# EAGLE design avr-programator (EAGLE 5.11)
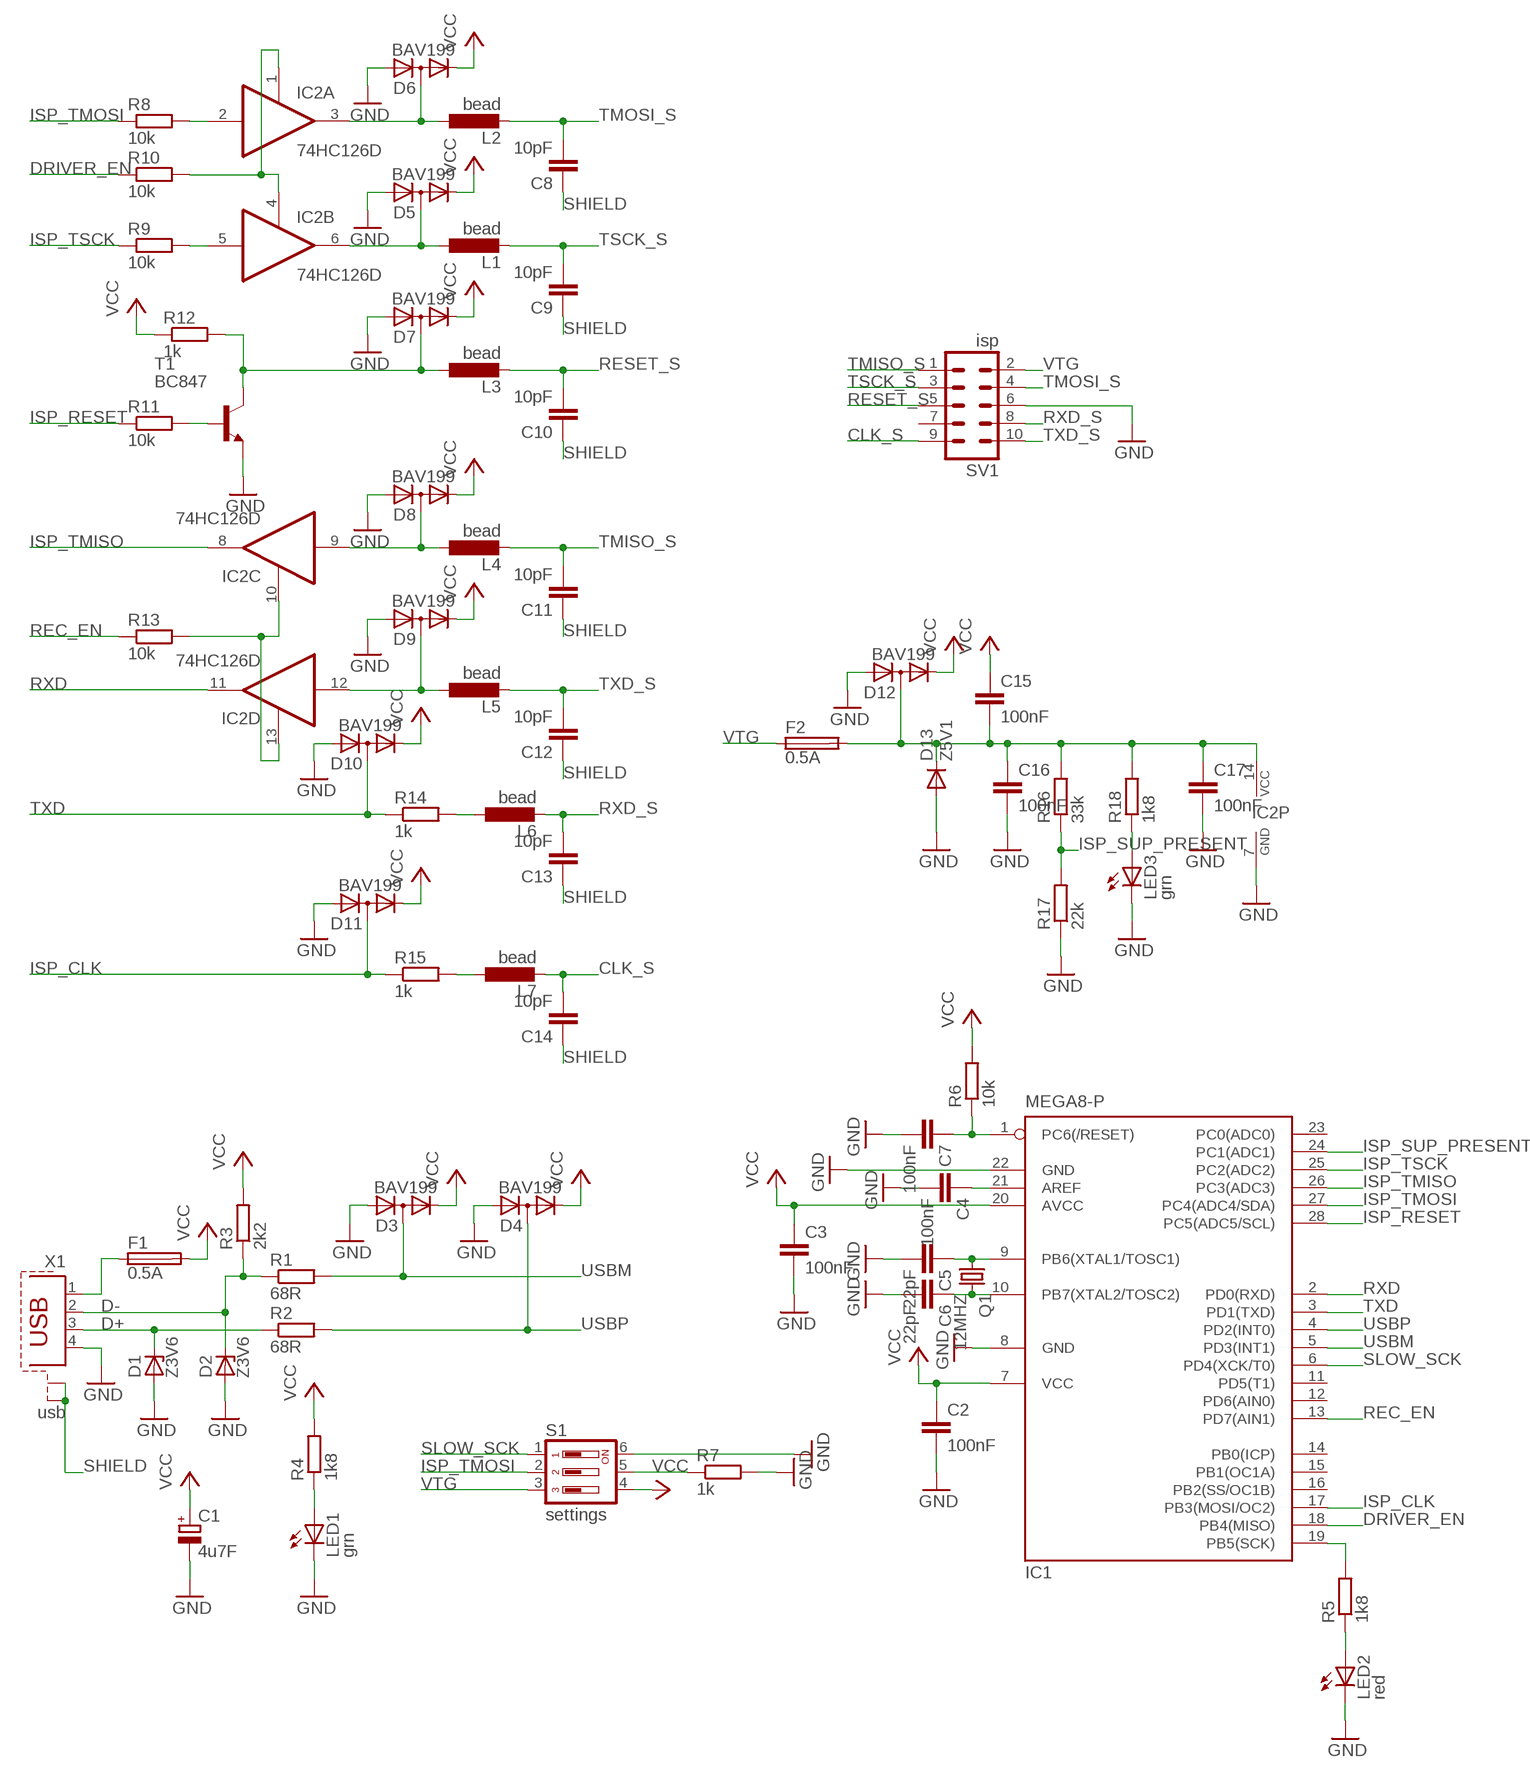
[diagram p0: schematic, sheet 1]

## Parts
C1  4u7F  CPOL-EUE2.5-5  [E2,5-5]
C2  100nF  C-EUC0805  [C0805]
C3  100nF  C-EUC0805  [C0805]
C4  100nF  C-EUC0805  [C0805]
C5  22pF  C-EUC0805  [C0805]
C6  22pF  C-EUC0805  [C0805]
C7  100nF  C-EUC0805  [C0805]
C8  10pF  C-EUC0805  [C0805]
C9  10pF  C-EUC0805  [C0805]
C10  10pF  C-EUC0805  [C0805]
C11  10pF  C-EUC0805  [C0805]
C12  10pF  C-EUC0805  [C0805]
C13  10pF  C-EUC0805  [C0805]
C14  10pF  C-EUC0805  [C0805]
C15  100nF  C-EUC0805  [C0805]
C16  100nF  C-EUC0805  [C0805]
C17  100nF  C-EUC0805  [C0805]
D1  Z3V6  1N4728  [DO41Z10]
D2  Z3V6  1N4728  [DO41Z10]
D3  BAV199  [SOT23]
D4  BAV199  [SOT23]
D5  BAV199  [SOT23]
D6  BAV199  [SOT23]
D7  BAV199  [SOT23]
D8  BAV199  [SOT23]
D9  BAV199  [SOT23]
D10  BAV199  [SOT23]
D11  BAV199  [SOT23]
D12  BAV199  [SOT23]
D13  Z5V1  DIODE-SOD523  [SOD523]
F1  0.5A  FUSE_0805  [0805]
F2  0.5A  FUSE_0805  [0805]
IC1  MEGA8-P  [DIL28-3]
IC2  74HC126D  [SO14]
L1  bead  L0805  [0805]
L2  bead  L0805  [0805]
L3  bead  L0805  [0805]
L4  bead  L0805  [0805]
L5  bead  L0805  [0805]
L6  bead  L0805  [0805]
L7  bead  L0805  [0805]
LED1  grn  LED3MM  [LED3MM]
LED2  red  LED3MM  [LED3MM]
LED3  grn  LED3MM  [LED3MM]
Q1  12MHZ  CRYSTALHC49S  [HC49/S]
R1  68R  R-EU_R0805  [R0805]
R2  68R  R-EU_R0805  [R0805]
R3  2k2  R-EU_R0805  [R0805]
R4  1k8  R-EU_R0805  [R0805]
R5  1k8  R-EU_0207/10  [0207/10]
R6  10k  R-EU_R0805  [R0805]
R7  1k  R-EU_R0805  [R0805]
R8  10k  R-EU_0207/12  [0207/12]
R9  10k  R-EU_0207/7  [0207/7]
R10  10k  R-EU_0207/7  [0207/7]
R11  10k  R-EU_0207/7  [0207/7]
R12  1k  R-EU_R0805  [R0805]
R13  10k  R-EU_0207/10  [0207/10]
R14  1k  R-EU_R0805  [R0805]
R15  1k  R-EU_R0805  [R0805]
R16  33k  R-EU_R0805  [R0805]
R17  22k  R-EU_R0805  [R0805]
R18  1k8  R-EU_0207/15  [0207/15]
S1  settings  DS03  [DS-03]
SV1  isp  ML10  [ML10]
T1  BC847  [SOT23]
X1  usb  MC32603  [MC32603P]

## Nets
CLK_S: C14.2 L7.2 SV1.9
D+: D1.C R2.1 X1.3
D-: D2.C R1.1 R3.1 X1.2
DRIVER_EN: IC1.18(PB4(MISO)) R10.1
GND: C1.- C2.2 C3.2 C4.2 C5.2 C6.2 C7.2 C16.2 C17.2 D1.A D2.A D3.1(A) D4.1(A) D5.1(A) D6.1(A) D7.1(A) D8.1(A) D9.1(A) D10.1(A) D11.1(A) D12.1(A) D13.A IC1.8(GND) IC1.22(GND) IC2.7(P:GND) LED1.K(C) LED2.K(C) LED3.K(C) R7.2 R17.1 S1.6 SV1.6 T1.2(E) X1.4
ISP_CLK: D11.3(AC) IC1.17(PB3(MOSI/OC2)) R15.1
ISP_RESET: IC1.28(PC5(ADC5/SCL)) R11.1
ISP_SUP_PRESENT: IC1.24(PC1(ADC1)) R16.1 R17.2
ISP_TMISO: IC1.26(PC3(ADC3)) IC2.8(C:O)
ISP_TMOSI: IC1.27(PC4(ADC4/SDA)) R8.1 S1.2
ISP_TSCK: IC1.25(PC2(ADC2)) R9.1
N$1: F1.1 X1.1
N$2: C4.1 IC1.21(AREF)
N$3: C6.1 IC1.10(PB7(XTAL2/TOSC2)) Q1.2
N$4: LED1.A R4.1
N$5: C5.1 IC1.9(PB6(XTAL1/TOSC1)) Q1.1
N$6: LED2.A R5.1
N$7: C7.1 IC1.1(PC6(/RESET)) R6.1
N$8: IC1.19(PB5(SCK)) R5.2
N$9: R7.1 S1.5
N$10: IC2.2(A:I) R8.2
N$11: IC2.5(B:I) R9.2
N$12: D6.3(AC) IC2.3(A:O) L2.1
N$13: IC2.1(A:OE) IC2.4(B:OE) R10.2
N$14: D5.3(AC) IC2.6(B:O) L1.1
N$15: R11.2 T1.1(B)
N$16: D7.3(AC) L3.1 R12.2 T1.3(C)
N$17: D8.3(AC) IC2.9(C:I) L4.1
N$18: D9.3(AC) IC2.12(D:I) L5.1
N$19: IC2.10(C:OE) IC2.13(D:OE) R13.2
N$20: L6.1 R14.2
N$21: L7.1 R15.2
N$22: C15.2 C16.1 C17.1 D12.3(AC) D13.C F2.2 IC2.14(P:VCC) R16.2 R18.2
N$23: LED3.A R18.1
REC_EN: IC1.13(PD7(AIN1)) R13.1
RESET_S: C10.2 L3.2 SV1.5
RXD: IC1.2(PD0(RXD)) IC2.11(D:O)
RXD_S: C13.2 L6.2 SV1.8
SHIELD: C8.1 C9.1 C10.1 C11.1 C12.1 C13.1 C14.1 X1.S1 X1.S2
SLOW_SCK: IC1.6(PD4(XCK/T0)) S1.1
TMISO_S: C11.2 L4.2 SV1.1
TMOSI_S: C8.2 L2.2 SV1.4
TSCK_S: C9.2 L1.2 SV1.3
TXD: D10.3(AC) IC1.3(PD1(TXD)) R14.1
TXD_S: C12.2 L5.2 SV1.10
USBM: D3.3(AC) IC1.5(PD3(INT1)) R1.2
USBP: D4.3(AC) IC1.4(PD2(INT0)) R2.2
VCC: C1.+ C2.1 C3.1 C15.1 D3.2(C) D4.2(C) D5.2(C) D6.2(C) D7.2(C) D8.2(C) D9.2(C) D10.2(C) D11.2(C) D12.2(C) F1.2 IC1.7(VCC) IC1.20(AVCC) R3.2 R4.2 R6.2 R12.1 S1.4
VTG: F2.1 S1.3 SV1.2
Unconnected: IC1.11(PD5(T1)) IC1.12(PD6(AIN0)) IC1.14(PB0(ICP)) IC1.15(PB1(OC1A)) IC1.16(PB2(SS/OC1B)) IC1.23(PC0(ADC0)) SV1.7

## Library data of the parts
C1 = resistor:CPOL-EU: POLARIZED CAPACITOR, European symbol
C2-C17 = resistor:C-EU: CAPACITOR, European symbol
D1 D2 = diode:1N4728: Z DIODE 3.3 V, 1W, 5 percent
D3-D12 = diode:BAV199: DIODE low-leakage double diode
D13 = diode:DIODE-: DIODE
F1 F2 = domen:FUSE_0805
IC1 = atmel:MEGA8-P: MICROCONTROLLER 8 Kbytes FLASH, 1 kbytes SRAM, 512 bytes EEPROM, USART, 4-channel 10 bit ADC, 2-channel 8 bit ADC Pin compatible with Atmega48, ATMega88, ATMega168 Source: avr.lbr; OC_FARNELL: unknown; OC_NEWARK: unknown
IC2 = 74xx-eu:74*126: Quad bus BUFFER, 3-state
L1-L7 = domen:L0805
LED1-LED3 = led:LED: LED OSRAM: - CHIPLED LG R971, LG N971, LY N971, LG Q971, LY Q971, LO R971, LY R971 LH N974, LH R974 LS Q976, LO Q976, LY Q976 LO Q996 - Hyper CHIPLED LW Q18S LB Q993, LB Q99A, LB R99A - SideLED LS A670, LO A670, LY A670, LG A670, LP A670 LB A673, LV A673, LT A673, LW A673 LH A674 LY A675 LS A676, LA A676, LO A676, LY A676, LW A676 LS A679, LY A679, LG A679 - Hyper Micro SIDELED® LS Y876, LA Y876, LO Y876, LY Y876 LT Y87S - SmartLED LW L88C, LW L88S LB L89C, LB L89S, LG L890 LS L89K, LO L89K, LY L89K LS L896, LA L896, LO L896, LY L896 - TOPLED LS T670, LO T670, LY T670, LG T670, LP T670 LSG T670, LSP T670, LSY T670, LOP T670, LYG T670 LG T671, LOG T671, LSG T671 LB T673, LV T673, LT T673, LW T673 LH T674 LS T676, LA T676, LO T676, LY T676, LB T676, LH T676, LSB T676, LW T676 LB T67C, LV T67C, LT T67C, LS T67K, LO T67K, LY T67K, LW E67C LS E67B, LA E67B, LO E67B, LY E67B, LB E67C, LV E67C, LT E67C LW T67C LS T679, LY T679, LG T679 LS T770, LO T770, LY T770, LG T770, LP T770 LB T773, LV T773, LT T773, LW T773 LH T774 LS E675, LA E675, LY E675, LS T675 LS T776, LA T776, LO T776, LY T776, LB T776 LHGB T686 LT T68C, LB T68C - Hyper Mini TOPLED® LB M676 - Mini TOPLED Santana® LG M470 LS M47K, LO M47K, LY M47K Source: http://www.osram.convergy.de LUXEON: - LUMILED® LXK2-PW12-R00, LXK2-PW12-S00, LXK2-PW14-U00, LXK2-PW14-V00 LXK2-PM12-R00, LXK2-PM12-S00, LXK2-PM14-U00 LXK2-PE12-Q00, LXK2-PE12-R00, LXK2-PE12-S00, LXK2-PE14-T00, LXK2-PE14-U00 LXK2-PB12-K00, LXK2-PB12-L00, LXK2-PB12-M00, LXK2-PB14-N00, LXK2-PB14-P00, LXK2-PB14-Q00 LXK2-PR12-L00, LXK2-PR12-M00, LXK2-PR14-Q00, LXK2-PR14-R00 LXK2-PD12-Q00, LXK2-PD12-R00, LXK2-PD12-S00 LXK2-PH12-R00, LXK2-PH12-S00 LXK2-PL12-P00, LXK2-PL12-Q00, LXK2-PL12-R00 Source: www.luxeon.com KINGBRIGHT: KA-3528ASYC Source: www.kingbright.com
Q1 = crystal:CRYSTAL: CRYSTAL; OC_FARNELL: 1667008; OC_NEWARK: unknown
R1-R18 = resistor:R-EU_: RESISTOR, European symbol
S1 = switch-dil:DS03: DIL/CODE SWITCH; OC_FARNELL: 1255223; OC_NEWARK: unknown
SV1 = con-ml:ML10: HARTING; OC_FARNELL: unknown; OC_NEWARK: unknown
T1 = transistor:BC847: NPN TRANSISTOR
X1 = domen:MC32603

## Board
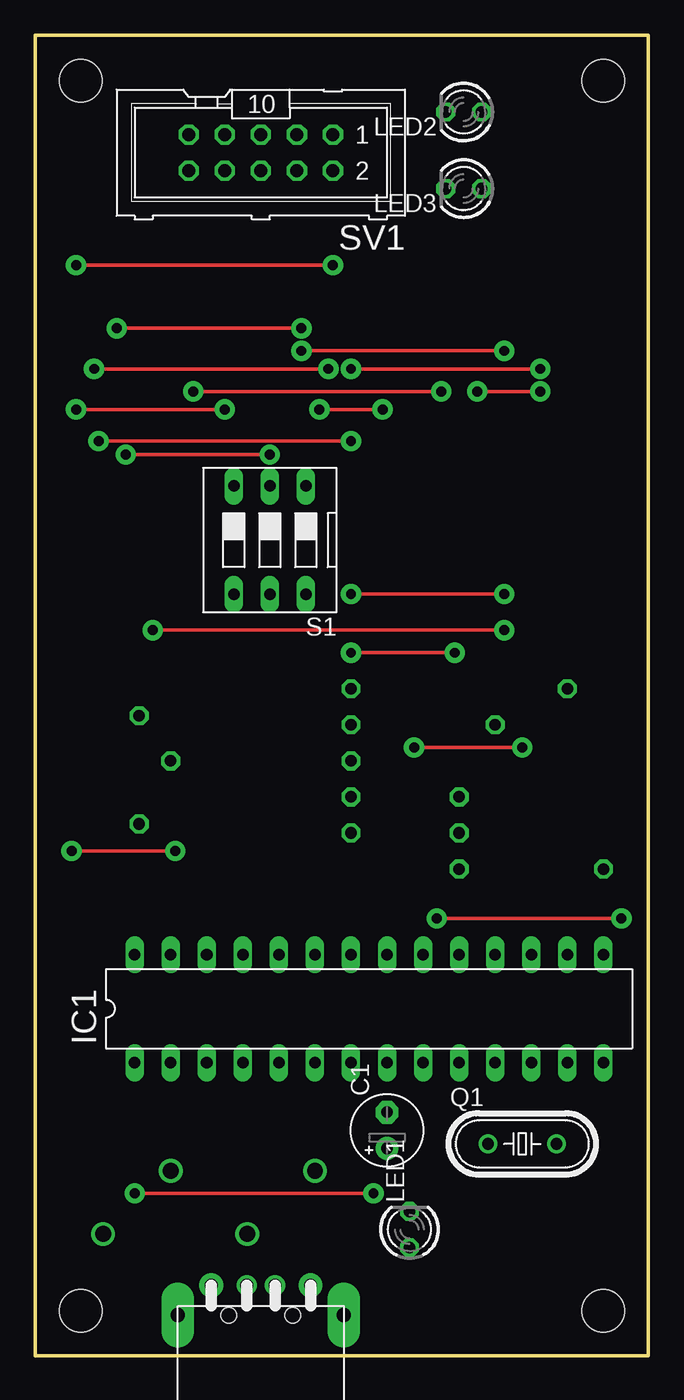
[diagram p1: board, top side]
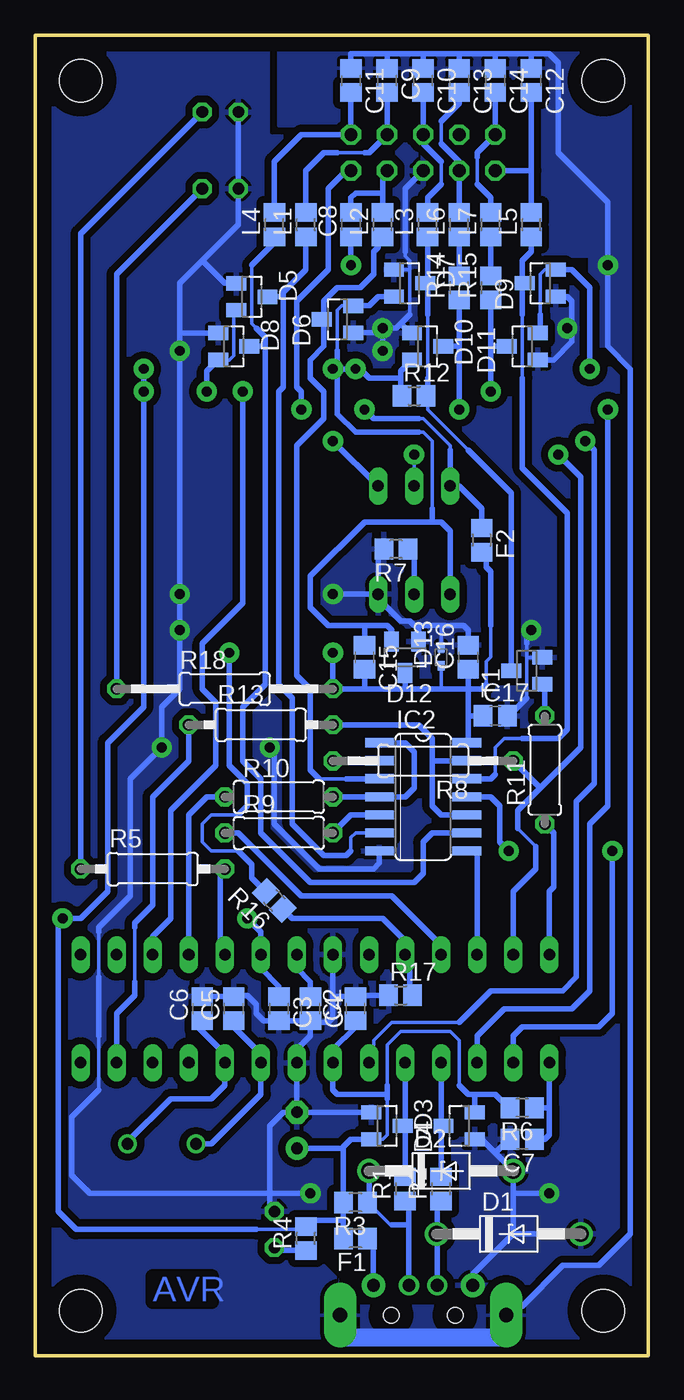
[diagram p2: board, bottom side, seen from below]

Size 43.18 x 93.03 mm. Coordinates in mm from the lower left corner, seen from the top.
Outline: 0,0 0,93.03 43.18,93.03 43.18,0 0,0
Copper layers (1*16): Top 0.035mm / dielectric 1.5mm / Bottom 0.035mm
Design rules: minimum track width 10mil, minimum drill 24mil, track to track 10mil, track to pad 10mil, pad to pad 10mil, via to via 10mil, smd to smd 8mil, copper to edge 40mil, drill to drill 8mil, minimum pad ring 10mil, minimum via ring 8mil, stop-mask expansion 4mil, vias tented up to drill 0mil, thermal gap 10mil
Holes 3 mm at 40.01,89.85 3.17,89.85 40.01,3.17 3.17,3.17

### Footprints (pad centres in the part's own frame; a part is rotated, then mirrored left to right if it is on the bottom)
E2,5-5 = drill 0.813 pad 1.6: + -1.27,0 | drill 0.813 pad 1.6 octagon: - 1.27,0
C0805 = smd 1.3 x 1.5: 1 -0.85,0; 2 0.85,0
DO41Z10 = drill 1.118: A 5.08,0; C -5.08,0
SOT23 = smd 1 x 1.4: 1 -0.95,-1.1; 2 0.95,-1.1; 3 0,1.1
SOD523 = smd 0.7 x 0.5: A 0.7,0; C -0.6,0
0805 = smd 1.3 x 1.5: 1 -0.85,0; 2 0.85,0
DIL28-3 = drill 0.813 long: 1 -16.51,-3.81; 2 -13.97,-3.81; 3 -11.43,-3.81; 4 -8.89,-3.81; 5 -6.35,-3.81; 6 -3.81,-3.81; 7 -1.27,-3.81; 8 1.27,-3.81; 9 3.81,-3.81; 10 6.35,-3.81; 11 8.89,-3.81; 12 11.43,-3.81; 13 13.97,-3.81; 14 16.51,-3.81; 15 16.51,3.81; 16 13.97,3.81; 17 11.43,3.81; 18 8.89,3.81; 19 6.35,3.81; 20 3.81,3.81; 21 1.27,3.81; 22 -1.27,3.81; 23 -3.81,3.81; 24 -6.35,3.81; 25 -8.89,3.81; 26 -11.43,3.81; 27 -13.97,3.81; 28 -16.51,3.81
SO14 = smd 0.66 x 2.032: 1 -3.81,-3.073; 2 -2.54,-3.073; 3 -1.27,-3.073; 4 0,-3.073; 5 1.27,-3.073; 6 2.54,-3.073; 7 3.81,-3.073; 8 3.81,3.073; 9 2.54,3.073; 10 1.27,3.073; 11 0,3.073; 12 -1.27,3.073; 13 -2.54,3.073; 14 -3.81,3.073
LED3MM = drill 0.813 octagon: A -1.27,0; K 1.27,0
HC49/S = drill 0.813: 1 -2.413,0; 2 2.413,0
R0805 = smd 1.3 x 1.5: 1 -0.85,0; 2 0.85,0
0207/10 = drill 0.813 octagon: 1 -5.08,0; 2 5.08,0
0207/12 = drill 0.813 octagon: 1 -6.35,0; 2 6.35,0
0207/7 = drill 0.813 octagon: 1 -3.81,0; 2 3.81,0
0207/15 = drill 0.813 octagon: 1 -7.62,0; 2 7.62,0
DS-03 = drill 0.813 long: 1 -2.54,-3.81; 2 0,-3.81; 3 2.54,-3.81; 4 2.54,3.81; 5 0,3.81; 6 -2.54,3.81
ML10 = drill 0.914 octagon: 1 -5.08,-1.27; 2 -5.08,1.27; 3 -2.54,-1.27; 4 -2.54,1.27; 5 0,-1.27; 6 0,1.27; 7 2.54,-1.27; 8 2.54,1.27; 9 5.08,-1.27; 10 5.08,1.27
MC32603P = drill 0.9 pad 1.676: 1 3.5,2.1; 4 -3.5,2.1 | drill 0.9 pad 1.422: 2 1,2.1; 3 -1,2.1 | drill 1 pad 2.3 long: S1 -5.85,0; S2 5.85,0 | hole 1.1: -2.25,0; 2.25,0

### Placement (x,y rotation side)
C1  24.77,15.88 90 top
C2  20.64,24.45 90 bottom
C3  26.04,24.45 270 bottom
C4  23.81,24.45 270 bottom
C5  29.21,24.45 90 bottom
C6  31.43,24.45 90 bottom
C7  8.89,15.24 180 bottom
C8  20.95,79.69 90 bottom
C9  18.41,89.85 270 bottom
C10  15.88,89.85 270 bottom
C11  20.95,89.85 270 bottom
C12  8.26,89.85 270 bottom
C13  13.34,89.85 270 bottom
C14  10.79,89.85 270 bottom
C15  20,49.21 270 bottom
C16  12.7,49.21 90 bottom
C17  10.79,45.09 0 bottom
D1  9.84,8.57 0 bottom
D2  14.61,13.02 0 bottom
D3  18.41,16.19 270 bottom
D4  13.34,16.19 90 bottom
D5  27.94,74.61 270 bottom
D6  21.91,73.03 90 bottom
D7  16.83,75.56 270 bottom
D8  29.21,71.12 270 bottom
D9  7.62,75.56 90 bottom
D10  15.56,71.12 270 bottom
D11  8.89,71.12 90 bottom
D12  17.14,49.21 180 bottom
D13  14.61,49.21 90 bottom
F1  20.64,8.26 180 bottom
F2  11.75,57.47 270 bottom
IC1  23.5,24.45 0 top
IC2  15.88,39.37 270 bottom
L1  24.13,79.69 90 bottom
L2  18.73,79.69 90 bottom
L3  15.56,79.69 90 bottom
L4  26.35,79.69 90 bottom
L5  8.26,79.69 90 bottom
L6  13.34,79.69 90 bottom
L7  11.11,79.69 90 bottom
LED1  26.35,8.89 90 top
LED2  30.16,87.63 180 top
LED3  30.16,82.23 180 top
Q1  34.29,14.92 0 top
R1  17.14,11.75 90 bottom
R2  14.61,11.75 90 bottom
R3  20.64,10.79 180 bottom
R4  24.13,8.26 90 bottom
R5  34.92,34.29 0 bottom
R6  8.89,17.46 180 bottom
R7  17.78,56.83 180 bottom
R8  15.88,41.91 180 bottom
R9  26.04,36.83 0 bottom
R10  26.04,39.37 0 bottom
R11  7.3,41.27 90 bottom
R12  16.51,67.63 0 bottom
R13  27.3,44.45 0 bottom
R14  13.34,75.25 90 bottom
R15  11.11,75.25 90 bottom
R16  26.35,32.07 135 bottom
R17  17.46,25.4 0 bottom
R18  29.84,46.99 0 bottom
S1  16.51,57.47 180 top
SV1  15.88,84.77 180 top
T1  8.57,48.26 90 bottom
X1  15.88,2.86 0 top

### Tracks (layer width: path | path; a pad name or v marks a point on that pad's centre or on a via)
CLK_S
  Bottom 0.254: 12.06,82.55 12.06,84.45
  Bottom 0.381: C14.2 SV1.9 12.06,84.77 12.06,84.45 | L7.2 11.11,81.6 12.06,82.55
D+
  Bottom 0.254: 14.88,10.63 R2.1 | D1.C 14.88,8.57
  Bottom 0.381: X1.3 14.88,8.53 D1.C 14.88,8.62 14.88,10.63
D-
  Bottom 0.254: R1.1 16.88,10.53 | 19.68,10.9 R3.1 18.2,9.21 18.1,9.21
  Bottom 0.381: X1.2 16.88,9.21 | 16.88,9.21 16.88,10.63 R1.1 | 19.68,10.79 19.68,10.9 D2.C | 16.88,9.21 18.1,9.21
DRIVER_EN
  Bottom 0.381: IC1.18 32.38,38.1 31.11,39.37 R10.1
GND  (via drill 0.7 pad 1.42)
  Top 0.254: v18.73,72.39 v5.71,72.39 | v6.99,11.43 v23.81,11.43 | v33.02,70.8 v18.73,70.8 | v33.02,53.66 v22.23,53.66 | v33.02,51.12 v8.26,51.12 | v34.29,42.86 v26.67,42.86
  Bottom 0.254: D7.1 18.1,76.83 | 16.83,72.07 D10.1 | D4.1 | 9.53,45.4 9.63,45.4 C17.2 | C7.2 9.53,15.03 | 16.83,76.52 | 8.57,46.35 8.57,49.21 | 8.57,49.21 T1.2 | D12.1 | 16.83,73.34 16.83,76.52 | 16.83,76.52 16.83,77.15 17.14,77.47 17.14,77.79 | 16.83,76.52 D7.1 | 38.73,26.67 38.73,29.84 | 38.73,18.73 38.73,22.54 | 14.61,51.44 D13.A | 8.57,49.21 8.57,50.48
  Bottom 0.381: SV1.6 17.14,82.23 17.14,77.79 | D7.1 | D9.1 5.72,74.61 5.4,74.3 5.4,72.71 v5.71,72.39 5.4,72.39 5.4,71.44 6.67,70.17 D11.1 | 18.73,72.07 D6.1 | v18.73,70.8 18.73,72.07 | 18.73,72.07 v18.73,72.39 17.78,72.39 17.46,72.71 | 17.46,72.71 16.83,73.34 | 16.83,72.07 17.46,72.71 | LED2.K LED3.K 28.89,79.69 31.43,77.15 | 33.02,72.07 v33.02,70.8 v33.02,53.66 v33.02,51.12 33.02,46.99 34.29,45.72 v34.29,42.86 36.51,40.64 36.51,32.38 38.73,30.16 38.73,29.84 | D8.1 32.7,72.07 33.02,72.07 | 33.02,72.07 33.02,75.56 31.43,77.15 | D5.1 29.84,75.56 31.43,77.15 | 38.73,22.54 38.73,26.67 | IC2.7 18.95,34.71 19.37,34.29 23.18,34.29 26.35,37.47 26.35,42.55 v26.67,42.86 | v22.23,53.66 S1.6 | S1.6 19.05,56.41 R7.2 | C16.2 12.7,51.12 13.02,51.44 14.61,51.44 16.19,51.44 | 16.19,51.44 16.51,51.44 16.83,51.75 17.46,51.75 18.73,53.02 18.73,53.34 S1.6 | D12.1 16.2,51.43 16.19,51.44 | v8.26,51.12 8.57,50.8 8.57,50.48 8.57,50.16 | 8.57,46.35 9.53,45.4 | D4.1 11.75,15.24 10.79,14.29 | 10.79,14.29 D2.A 9.53,11.43 | C7.2 9.84,15.24 10.79,14.29 | D3.1 C1.- | C1.- IC1.8 24.77,21.59 23.81,22.54 C4.2 | 26.67,11.43 26.67,10.48 LED1.K | 26.67,11.43 26.67,16.19 25.72,17.14 C1.- | v23.81,11.43 26.67,11.43 | 26.67,11.43 39.37,11.43 40.64,12.7 40.64,16.83 38.73,18.73 | 9.53,8.57 9.53,11.43 | D1.A 9.53,8.57 | 9.53,11.43 v6.99,11.43 | X1.4 12.38,5.72 9.53,8.57 | R17.1 20.54,25.4 C2.2 22.12,25.3 22.23,25.4 | 22.23,25.4 22.23,23.81 22.54,23.5 23.71,23.5 C4.2 | 22.23,25.4 IC1.22 | C4.2 C3.2 27.09,23.6 27.62,24.13 27.62,24.77 28.26,25.4 29.11,25.4 C5.2 C6.2
  pour Bottom (isolate 0.508, rank 2): 0,93.03 43.18,93.03 43.18,0 0,0
ISP_CLK  (via drill 0.7 pad 1.42)
  Top 0.254: v28.57,67.94 v11.11,67.94
  Bottom 0.381: v11.11,67.94 11.11,71.12 | 11.11,71.12 R15.1 | 11.11,71.12 D11.3 | v28.57,67.94 28.57,53.02 31.43,50.16 31.43,46.99 30.48,46.04 30.48,41.59 33.66,38.42 33.66,30.8 34.92,29.53 IC1.17
ISP_RESET
  Bottom 0.381: IC1.28 6.99,32.7 6.67,33.02 6.67,36.83 R11.1
ISP_SUP_PRESENT
  Bottom 0.254: R17.2 17.14,25.61
  Bottom 0.381: R16.1 25.08,30.8 18.73,30.8 17.14,29.21 IC1.24 17.14,27.62 16.83,27.3 16.83,25.61 R17.2
ISP_TMISO
  Bottom 0.254: IC2.8 12.38,35.56
  Bottom 0.381: IC1.26 12.06,35.56 IC2.8
ISP_TMOSI  (via drill 0.7 pad 1.42)
  Top 0.254: v6.35,63.5 v16.51,63.5
  Bottom 0.254: v16.51,63.5 S1.2 | 7.94,35.88 9.21,37.15 | R8.1
  Bottom 0.381: 7.94,35.88 7.94,34.29 9.53,32.7 IC1.27 | 9.21,37.15 9.21,38.42 7.62,40.01 | 7.62,40.01 4.76,42.86 4.76,61.91 v6.35,63.5 | 7.62,40.01 R8.1
ISP_TSCK
  Bottom 0.381: R9.1 28.89,36.83 24.45,32.38 18.1,32.38 14.61,28.89 IC1.25
N$1
  Bottom 0.381: X1.1 19.38,7.84 F1.1
N$2
  Bottom 0.381: C4.1 23.81,26.35 24.77,27.3 IC1.21
N$3
  Bottom 0.381: Q1.2 36.7,15.05 33.66,18.1 30.8,18.1 29.84,19.05 IC1.10 29.84,21.27 31.75,23.18 31.75,23.28 C6.1
N$4
  Bottom 0.381: R4.1 26.14,7.41 LED1.A
N$5
  Bottom 0.381: Q1.1 30.8,14.92 27.3,18.41 IC1.9 27.3,21.27 29.21,23.18 C5.1
N$6
  Bottom 0.381: LED2.A 31.43,87.31 31.75,87.31 40.01,79.06 R5.1
N$7
  Bottom 0.381: 6.99,17.46 6.99,15.56 7.3,15.24 C7.1 | 6.99,17.46 IC1.1 | 6.99,17.46 R6.1
N$8
  Bottom 0.381: R5.2 30.16,33.97 30.16,28.57 IC1.19
N$9
  Bottom 0.254: 16.51,56.41 R7.1
  Bottom 0.381: S1.5 16.51,56.41
N$10
  Bottom 0.381: IC2.2 R8.2
N$11
  Bottom 0.381: R9.2 20.95,38.1 IC2.5
N$12
  Bottom 0.254: D6.3 22.86,72.71 | 21.27,40.64 23.18,40.64
  Bottom 0.381: L2.1 18.73,78.74 19.05,78.42 19.05,78.11 19.37,77.79 19.37,76.2 20.32,75.25 21.91,75.25 22.86,74.3 22.86,73.17 D6.3 22.86,72.88 22.86,71.12 23.81,70.17 23.81,68.9 22.86,67.94 22.86,66.04 24.77,64.14 24.77,47.94 23.81,46.99 23.81,41.27 23.18,40.64 | IC2.3 21.27,40.64
N$13
  Bottom 0.381: R10.2 IC2.4 17.14,39.37 16.51,40.01 16.51,42.55 17.14,43.18 IC2.1
N$14
  Bottom 0.254: 20.95,35.56 20.95,36.51 20.64,36.83 IC2.6
  Bottom 0.381: 25.72,74.61 25.72,68.26 26.04,67.94 26.04,47.31 25.08,46.35 25.08,37.47 22.86,35.24 21.27,35.24 20.95,35.56 | 25.72,74.61 25.72,74.93 24.13,76.52 L1.1 | 25.72,74.61 D5.3
N$15
  Bottom 0.381: R11.2 7.3,47.14 T1.1
N$16
  Bottom 0.254: D7.3 15.56,75.56 | R12.2 15.56,68.05 | 15.56,68.9 15.56,73.34 | 12.7,63.82 15.56,66.67 15.56,67.53
  Bottom 0.381: L3.1 15.56,75.73 D7.3 15.73,75.42 15.56,75.25 15.56,73.34 | 15.56,68.05 15.56,68.9 | T1.3 9.67,60.79 12.7,63.82 | 15.56,67.53 R12.2
N$17
  Bottom 0.254: 27.94,76.83 27.94,72.71 27.62,72.39
  Bottom 0.381: 26.99,71.12 26.99,71.75 27.62,72.39 | 26.99,71.12 D8.3 | L4.1 26.35,78.42 27.94,76.83 | 26.99,71.12 26.99,47.31 28.57,45.72 28.57,41.91 27.3,40.64 27.3,36.83 23.81,33.34 16.51,33.34 15.88,33.97 15.88,36.2 15.24,36.83 IC2.9
N$18
  Bottom 0.254: 8.89,75.88 D9.3 8.89,75.56 | 8.89,68.9 8.89,73.34 | 10.79,40.96 10.79,42.86 10.16,43.5 8.89,43.5
  Bottom 0.381: L5.1 8.26,77.79 8.89,77.15 8.89,75.73 D9.3 | 8.89,73.34 8.89,75.56 | 8.89,68.9 8.89,62.55 5.71,59.37 5.71,44.13 6.35,43.5 8.89,43.5 | IC2.12 11.11,40.64 10.79,40.96
N$19
  Bottom 0.381: IC2.10 14.61,38.1 15.24,38.73 15.24,41.91 | 15.24,41.91 15.24,43.5 16.19,44.45 R13.2 | 15.24,41.91 IC2.13
N$20
  Bottom 0.381: R14.2 L6.1
N$21
  Bottom 0.381: R15.2 L7.1
N$22  (via drill 0.7 pad 1.42)
  Top 0.254: v22.23,49.53 v29.53,49.53
  Bottom 0.254: 14.61,46.99 D13.C | 12.7,43.28 IC2.14 | 28.89,38.1 30.8,38.1 31.43,37.47 31.43,36.2 30.8,35.56 28.89,35.56 | 11.11,51.44 11.11,49.21 11.43,48.9 11.43,47.31
  Bottom 0.381: v29.53,49.53 29.53,41.59 28.26,40.32 28.26,38.73 28.89,38.1 | R16.2 27.94,33.66 27.94,34.61 28.89,35.56 | v22.23,49.53 R18.2 20,46.99 | 17.14,46.99 14.61,46.99 12.7,46.99 | 17.14,46.99 20,46.99 | 17.14,46.99 D12.3 | 20,46.99 C15.2 | 12.7,45.09 12.7,43.28 12.7,43.18 | 12.7,45.09 12.7,46.99 | 12.7,46.99 C16.1 | C17.1 12.7,45.09 | 12.7,46.99 11.75,46.99 11.43,47.31 | 11.11,51.44 11.11,55.24 11.43,55.56 11.43,56.3 F2.2
N$23
  Bottom 0.381: LED3.A 37.47,76.2 R18.1
REC_EN
  Bottom 0.254: 36.2,25.4 36.2,30.16
  Bottom 0.381: R13.1 32.38,41.91 34.92,39.37 34.92,31.75 36.2,30.48 36.2,30.16 | IC1.13 37.47,24.13 36.2,25.4 36.2,26.35
RESET_S
  Bottom 0.254: 14.61,82.55 14.61,84.14
  Bottom 0.381: C10.2 SV1.5 15.88,85.41 14.61,84.14 | L3.2 15.56,81.6 14.61,82.55
RXD  (via drill 0.7 pad 1.42)
  Top 0.254: v2.54,35.56 v9.84,35.56
  Bottom 0.381: IC2.11 11.11,39.37 10.48,38.73 10.48,36.2 v9.84,35.56 | v2.54,35.56 2.54,24.13 3.49,23.18 8.89,23.18 9.53,22.54 IC1.2
RXD_S
  Bottom 0.254: 14.61,85.41 14.61,87
  Bottom 0.381: L6.2 SV1.8 | SV1.8 13.34,83.82 | C13.2 13.34,88.27 14.61,87 | 14.61,85.41 13.34,84.14 SV1.8
SHIELD  (via drill 0.7 pad 1.42)
  Top 0.254: v2.86,76.83 v20.95,76.83
  Bottom 0.381: C11.1 20.95,91.76 18.41,91.76 | 8.26,91.76 6.99,91.76 6.35,91.12 6.35,84.77 2.86,81.28 v2.86,76.83 2.86,71.12 1.27,69.53 1.27,8.57 3.49,6.35 6.03,6.35 8.89,3.49 X1.S1 | 8.26,91.76 10.79,91.76 | 10.79,91.76 13.34,91.76 | 13.34,91.76 15.88,91.76 | 15.88,91.76 18.41,91.76 | 8.26,91.76 C12.1 | 10.79,91.76 C14.1 | 13.34,91.76 C13.1 | 15.88,91.76 C10.1 | 18.41,91.76 C9.1 | v20.95,76.83 C8.1
  Bottom 1.27: X1.S1 10.03,2.04 10.16,1.27 21.59,1.27 21.59,3.36 X1.S2
  pour Bottom (isolate 0.508): 43.18,8.89 43.18,0 0,0 0,93.03 26.04,93.03 26.04,86.68 8.26,86.68 8.26,77.47 4.13,77.47 4.13,71.12 2.86,71.12 1.27,69.53 1.27,8.57 3.49,6.35 5.71,6.35 8.57,3.49 21.91,3.49 21.91,5.4 25.4,8.89
SLOW_SCK  (via drill 0.7 pad 1.42)
  Top 0.254: v4.45,64.45 v22.23,64.45
  Bottom 0.254: IC1.6 19.68,21.59 19.37,21.91 19.37,22.23 18.1,23.5 13.34,23.5
  Bottom 0.381: v22.23,64.45 S1.1 | v4.45,64.45 3.81,63.82 3.81,40.32 5.08,39.05 5.08,26.67 6.03,25.72 11.11,25.72 13.34,23.5
TMISO_S
  Bottom 0.381: C11.2 SV1.1 24.45,86.04 26.35,84.14 L4.2
TMOSI_S
  Bottom 0.254: L2.2 18.41,80.86 | C8.2 20.95,80.64
  Bottom 0.381: SV1.4 18.73,83.19 18.73,81.92 | 18.73,81.92 20.64,81.92 20.95,81.6 C8.2 | L2.2 18.73,81.92
TSCK_S
  Bottom 0.254: 20,84.77 21.91,84.77
  Bottom 0.381: C9.2 SV1.3 19.68,84.77 20,84.77 | L1.2 24.13,83.5 22.86,84.77 21.91,84.77
TXD  (via drill 0.7 pad 1.42)
  Top 0.254: v2.86,66.67 v13.34,66.67
  Bottom 0.381: v13.34,66.67 13.34,71.12 | 13.34,71.12 R14.1 | 13.34,71.12 D10.3 | v2.86,66.67 2.86,38.73 4.13,37.47 4.13,25.72 5.4,24.45 10.16,24.45 12.06,22.54 IC1.3
TXD_S
  Bottom 0.381: L5.2 8.26,83.5 | 8.26,83.5 C12.2 | 8.26,83.5 SV1.10
USBM
  Bottom 0.381: IC1.5 17.14,16.36 D3.3 17.14,16.02 R1.2
USBP
  Bottom 0.381: IC1.4 14.61,16.36 D4.3 14.61,16.02 R2.2
VCC  (via drill 0.7 pad 1.42)
  Top 0.254: v20.64,69.53 v4.13,69.53 | v35.56,69.53 v22.23,69.53 | v35.56,67.94 v31.11,67.94 | v41.27,30.8 v28.26,30.8
  Bottom 0.254: 7.62,72.24 D11.2 | D3.2 18.73,15.24 18.41,15.56 18.41,18.1 | D9.2 7.3,76.52 7.62,76.2 7.62,73.34 | D10.2 | D4.2 | 24.45,8.89 23.81,9.53 23.5,9.53 23.91,9.11 R4.2 24.34,8.89 27.62,8.89 | 40.96,30.8 40.8,30.96 | D6.2 21.59,73.97 21.91,73.66 21.91,70.8 | D5.2 29.21,73.66 29.21,70.48 29.53,70.17 D8.2 | 16.19,65.09 15.88,65.09 15.24,64.45 15.24,59.69 | 13.34,19.05 13.34,22.23 13.97,22.86 17.46,22.86 18.41,21.91 18.41,19.05
  Bottom 0.381: D7.2 19.05,74.61 19.68,73.98 D6.2 | D9.2 5.4,76.52 4.13,75.25 v4.13,69.53 | 7.62,73.34 7.62,72.24 | 21.91,69.53 v20.64,69.53 20.32,69.53 19.68,68.9 17.46,68.9 | 21.91,69.53 21.91,66.36 20.64,65.09 16.19,65.09 | 21.91,69.53 21.91,70.8 | v22.23,69.53 21.91,69.53 | 17.46,68.9 17.46,69.36 D10.2 | 17.46,68.9 17.46,67.73 R12.1 | D8.2 30.48,70.17 | v31.11,67.94 31.11,69.36 D8.2 | v35.56,69.53 v35.56,67.94 35.56,45.72 38.1,43.18 38.1,32.7 40.01,30.8 40.64,30.8 40.8,30.96 | 40.96,30.8 v41.27,30.8 41.59,30.48 41.59,10.16 40.32,8.89 27.62,8.89 | v28.26,30.8 27.3,29.84 IC1.20 27.3,27.3 26.04,26.04 C3.1 | D12.2 18.09,51.12 18.41,51.44 20,51.44 | 20,51.44 22.54,51.44 23.81,52.7 23.81,54.93 20,58.74 15.24,58.74 | 20,51.44 C15.1 | S1.4 13.97,58.1 14.61,58.74 15.24,58.74 | 15.24,59.69 15.24,58.74 | 10.06,17.14 R6.2 10.06,17.78 10.16,17.78 10.79,18.41 12.38,18.41 | 13.34,19.05 12.7,18.41 12.38,18.41 | D4.2 12.23,18.27 12.38,18.41 | 21.49,9.53 R3.2 21.49,14.61 | 21.49,9.53 F1.2 | 21.49,9.53 23.5,9.53 | 21.49,14.61 21.49,14.71 20.95,15.24 D3.2 | 21.49,14.61 C1.+ | 18.41,18.41 21.91,18.41 22.23,18.73 IC1.7 22.23,21.59 20.64,23.18 C2.1 | 18.41,19.05 18.41,18.41 | 18.41,18.41 18.41,18.1
VTG  (via drill 0.7 pad 1.42)
  Top 0.254: v20,66.67 v24.45,66.67
  Bottom 0.254: 13.97,63.82 13.97,64.14 15.88,66.04 16.19,66.04
  Bottom 0.381: SV1.2 21.27,83.5 22.54,82.23 22.54,76.52 24.77,74.3 24.77,68.26 24.45,67.94 v24.45,66.67 | 13.97,63.82 S1.3 13.34,61.28 11.75,59.69 F2.1 | 16.19,66.04 19.37,66.04 v20,66.67

### Text on the board
Bottom: AVR